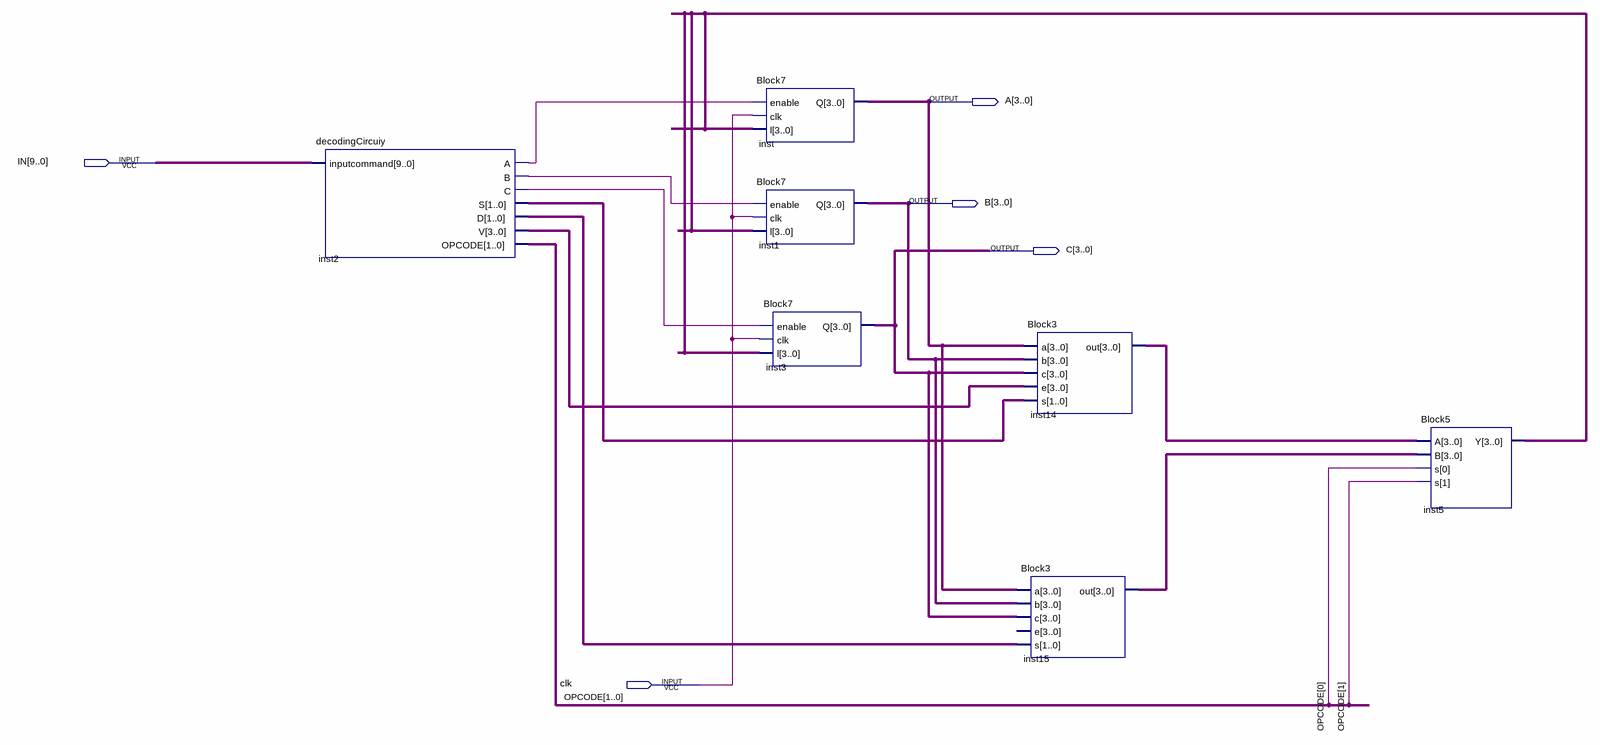
[diagram p0: schematic sheet]
// Quartus schematic EUnew.bdf as structural Verilog: 7 symbols, 5 pins
module EUnew (
  input  [9:0] IN,
  input  clk,
  output [3:0] A,
  output [3:0] B,
  output [3:0] C
);

  wire inst2_a, inst2_b, inst2_c;
  wire [1:0] inst2_d, inst2_s, OPCODE;
  wire [3:0] inst2_v, inst5_y, inst14_out, inst15_out;

  decodingCircuiy inst2 (
    .inputcommand(IN), .A(inst2_a), .B(inst2_b), .C(inst2_c), .S(inst2_s), .D(inst2_d), .V(inst2_v),
    .OPCODE(OPCODE));
  Block7 inst (.enable(inst2_a), .clk(clk), .l(inst5_y), .Q(A));
  Block7 inst1 (.enable(inst2_b), .clk(clk), .l(inst5_y), .Q(B));
  Block7 inst3 (.enable(inst2_c), .clk(clk), .l(inst5_y), .Q(C));
  Block3 inst14 (.a(A), .b(B), .c(C), .e(inst2_v), .s(inst2_s), .out(inst14_out));
  Block3 inst15 (.a(A), .b(B), .c(C), .s(inst2_d), .out(inst15_out));  // open: e
  Block5 inst5 (.A(inst14_out), .B(inst15_out), .s(OPCODE), .Y(inst5_y));
endmodule
